# EAGLE design breakoutboard2 (EAGLE 5.06)
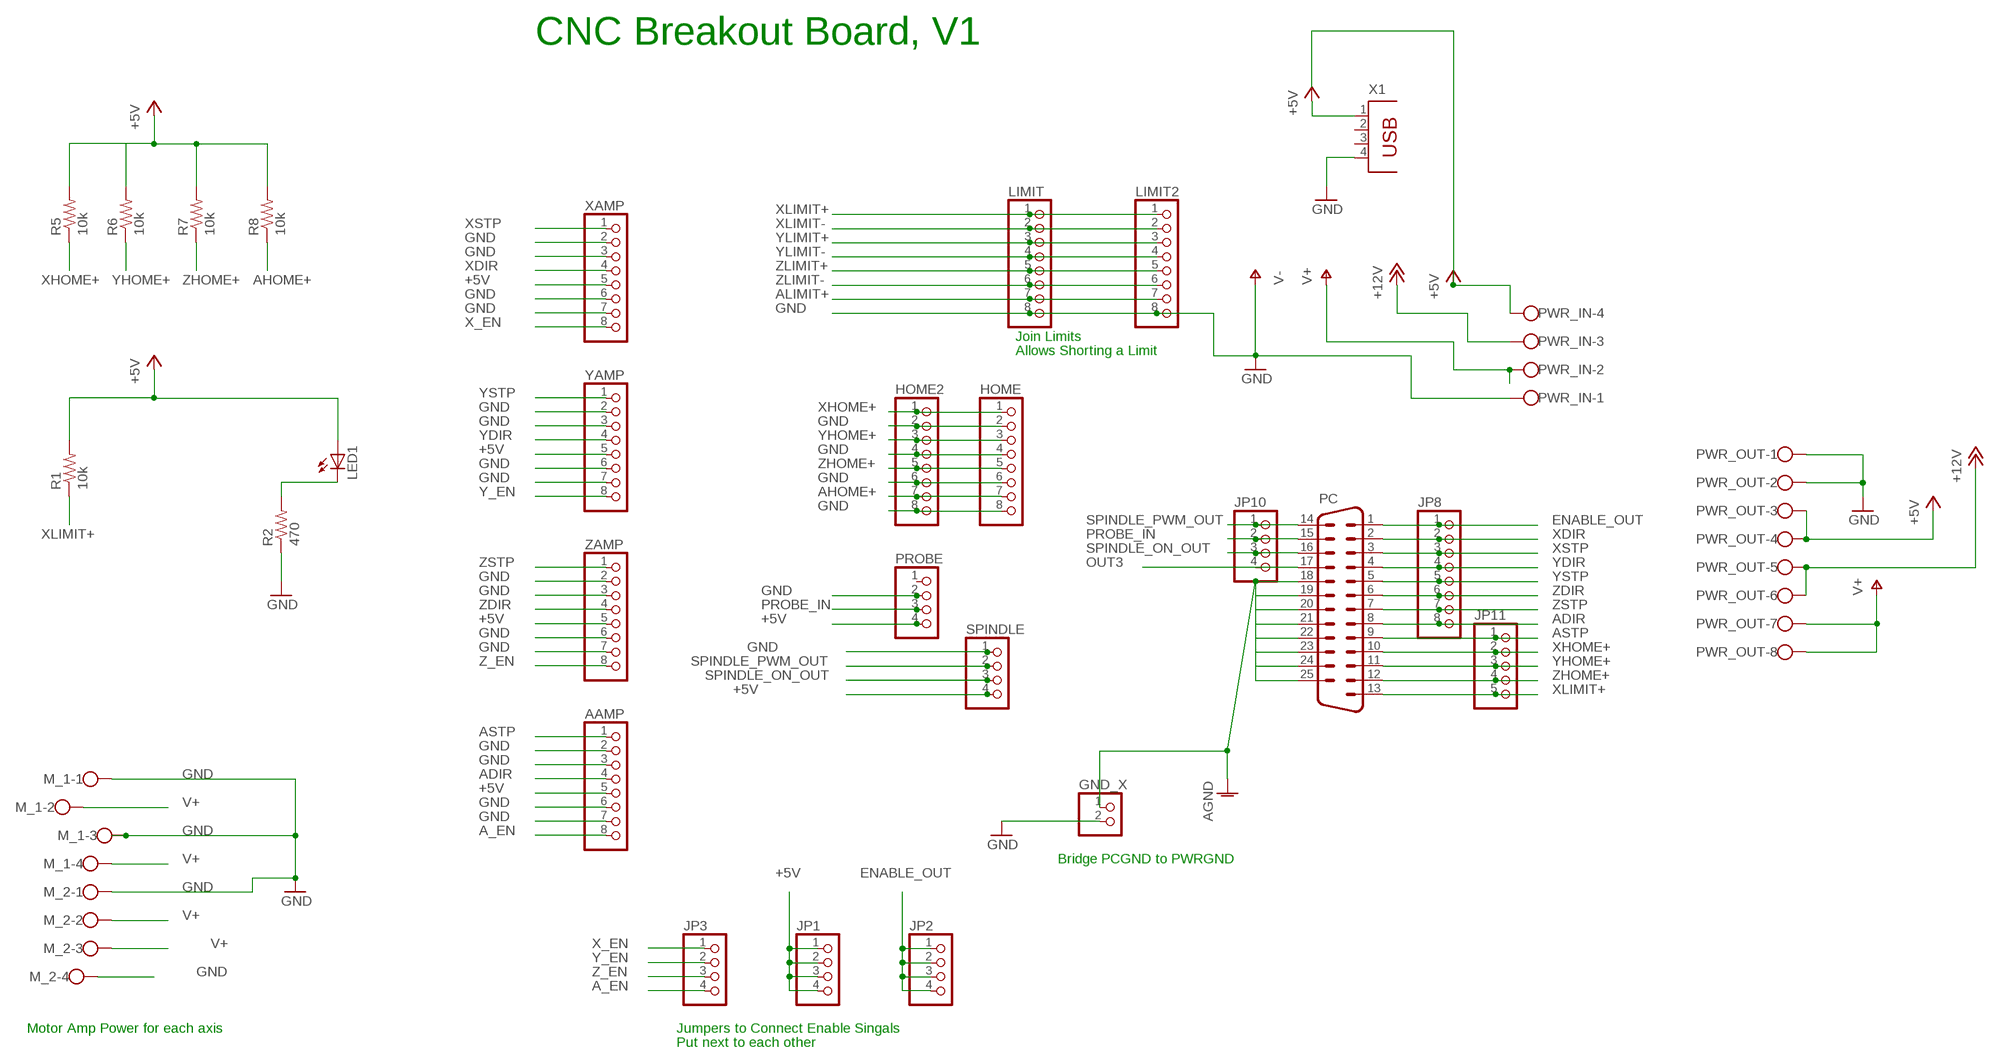
[diagram p0: schematic, sheet 1]

## Parts
AAMP  PINHD-1X8  [1X08]
GND_X  PINHD-1X2  [1X02]
HOME  PINHD-1X8  [1X08]
HOME2  PINHD-1X8  [1X08]
JP1  PINHD-1X4  [1X04]
JP2  PINHD-1X4  [1X04]
JP3  PINHD-1X4  [1X04]
JP8  PINHD-1X8  [1X08]
JP10  PINHD-1X4  [1X04]
JP11  PINHD-1X5  [1X05]
LED1  LED3MM  [LED3MM]
LIMIT  PINHD-1X8  [1X08]
LIMIT2  PINHD-1X8  [1X08]
M_1  W237-04P  [W237-4P]
M_2  W237-04P  [W237-4P]
PC  M25HP  [M25HP]
PROBE  PINHD-1X4  [1X04]
PWR_IN  W237-04P  [W237-4P]
PWR_OUT  W237-08P  [W237-8P]
R1  10k  R-US_0204/7  [0204/7]
R2  470  R-US_0204/2V  [0204V]
R5  10k  R-US_0204/7  [0204/7]
R6  10k  R-US_0204/7  [0204/7]
R7  10k  R-US_0204/7  [0204/7]
R8  10k  R-US_0204/7  [0204/7]
SPINDLE  PINHD-1X4  [1X04]
X1  PN61729  [PN61729]
XAMP  PINHD-1X8  [1X08]
YAMP  PINHD-1X8  [1X08]
ZAMP  PINHD-1X8  [1X08]

## Nets
+5V: AAMP.5 JP1.1 JP1.2 JP1.3 JP1.4 LED1.A PROBE.4 PWR_IN.4 PWR_OUT.3 PWR_OUT.4 R1.2 R5.2 R6.2 R7.2 R8.2 SPINDLE.4 X1.1 XAMP.5 YAMP.5 ZAMP.5
+12V: PWR_IN.3 PWR_OUT.5 PWR_OUT.6
A_EN: AAMP.8 JP3.4
ADIR: AAMP.4 JP8.8 PC.8
AGND: GND_X.1 PC.18 PC.19 PC.20 PC.21 PC.22 PC.23 PC.24 PC.25
AHOME+: HOME2.7 HOME.7 R8.1
ALIMIT+: LIMIT2.7 LIMIT.7
ASTP: AAMP.1 JP11.1 PC.9
ENABLE_OUT: JP2.1 JP2.2 JP2.3 JP2.4 JP8.1 PC.1
GND: AAMP.2 AAMP.3 AAMP.6 AAMP.7 GND_X.2 HOME2.2 HOME2.4 HOME2.6 HOME2.8 HOME.2 HOME.4 HOME.6 HOME.8 LIMIT2.8 LIMIT.8 M_1.1 M_1.3 M_2.1 M_2.4 PROBE.2 PWR_IN.1 PWR_OUT.1 PWR_OUT.2 R2.1 SPINDLE.1 X1.4 XAMP.2 XAMP.3 XAMP.6 XAMP.7 YAMP.2 YAMP.3 YAMP.6 YAMP.7 ZAMP.2 ZAMP.3 ZAMP.6 ZAMP.7 ; supply symbol labelled V-
N$1: LED1.K(C) R2.2
OUT3: JP10.4 PC.17
PROBE_IN: JP10.2 PC.15 PROBE.3
SPINDLE_ON_OUT: JP10.3 PC.16 SPINDLE.3
SPINDLE_PWM_OUT: JP10.1 PC.14 SPINDLE.2
V+: M_1.2 M_1.4 M_2.2 M_2.3 PWR_IN.2 PWR_OUT.7 PWR_OUT.8
X_EN: JP3.1 XAMP.8
XDIR: JP8.2 PC.2 XAMP.4
XHOME+: HOME2.1 HOME.1 JP11.2 PC.10 R5.1
XLIMIT+: JP11.5 LIMIT2.1 LIMIT.1 PC.13 R1.1
XLIMIT-: LIMIT2.2 LIMIT.2
XSTP: JP8.3 PC.3 XAMP.1
Y_EN: JP3.2 YAMP.8
YDIR: JP8.4 PC.4 YAMP.4
YHOME+: HOME2.3 HOME.3 JP11.3 PC.11 R6.1
YLIMIT+: LIMIT2.3 LIMIT.3
YLIMIT-: LIMIT2.4 LIMIT.4
YSTP: JP8.5 PC.5 YAMP.1
Z_EN: JP3.3 ZAMP.8
ZDIR: JP8.6 PC.6 ZAMP.4
ZHOME+: HOME2.5 HOME.5 JP11.4 PC.12 R7.1
ZLIMIT+: LIMIT2.5 LIMIT.5
ZLIMIT-: LIMIT2.6 LIMIT.6
ZSTP: JP8.7 PC.7 ZAMP.1
Unconnected: PROBE.1 X1.2 X1.3

## Notes on the sheet
- CNC Breakout Board, V1
- Join Limits
- Allows Shorting a Limit
- Bridge PCGND to PWRGND
- Motor Amp Power for each axis | Jumpers to Connect Enable Singals
- Put next to each other

## Library data of the parts
AAMP HOME HOME2 JP8 LIMIT LIMIT2 XAMP YAMP ZAMP = pinhead:PINHD-1X8: PIN HEADER
GND_X = pinhead:PINHD-1X2: PIN HEADER
JP1-JP3 JP10 PROBE SPINDLE = pinhead:PINHD-1X4: PIN HEADER
JP11 = pinhead:PINHD-1X5: PIN HEADER
LED1 = led:LED: LED OSRAM: - CHIPLED LG R971, LG N971, LY N971, LG Q971, LY Q971, LO R971, LY R971 LH N974, LH R974 LS Q976, LO Q976, LY Q976 LO Q996 - Hyper CHIPLED LW Q18S LB Q993, LB Q99A, LB R99A - SideLED LS A670, LO A670, LY A670, LG A670, LP A670 LB A673, LV A673, LT A673, LW A673 LH A674 LY A675 LS A676, LA A676, LO A676, LY A676, LW A676 LS A679, LY A679, LG A679 - Hyper Micro SIDELED® LS Y876, LA Y876, LO Y876, LY Y876 LT Y87S - SmartLED LW L88C, LW L88S LB L89C, LB L89S, LG L890 LS L89K, LO L89K, LY L89K LS L896, LA L896, LO L896, LY L896 - TOPLED LS T670, LO T670, LY T670, LG T670, LP T670 LSG T670, LSP T670, LSY T670, LOP T670, LYG T670 LG T671, LOG T671, LSG T671 LB T673, LV T673, LT T673, LW T673 LH T674 LS T676, LA T676, LO T676, LY T676, LB T676, LH T676, LSB T676, LW T676 LB T67C, LV T67C, LT T67C, LS T67K, LO T67K, LY T67K, LW E67C LS E67B, LA E67B, LO E67B, LY E67B, LB E67C, LV E67C, LT E67C LW T67C LS T679, LY T679, LG T679 LS T770, LO T770, LY T770, LG T770, LP T770 LB T773, LV T773, LT T773, LW T773 LH T774 LS E675, LA E675, LY E675, LS T675 LS T776, LA T776, LO T776, LY T776, LB T776 LHGB T686 LT T68C, LB T68C - Hyper Mini TOPLED® LB M676 - Mini TOPLED Santana® LG M470 LS M47K, LO M47K, LY M47K Source: http://www.osram.convergy.de LUXEON: - LUMILED® LXK2-PW12-R00, LXK2-PW12-S00, LXK2-PW14-U00, LXK2-PW14-V00 LXK2-PM12-R00, LXK2-PM12-S00, LXK2-PM14-U00 LXK2-PE12-Q00, LXK2-PE12-R00, LXK2-PE12-S00, LXK2-PE14-T00, LXK2-PE14-U00 LXK2-PB12-K00, LXK2-PB12-L00, LXK2-PB12-M00, LXK2-PB14-N00, LXK2-PB14-P00, LXK2-PB14-Q00 LXK2-PR12-L00, LXK2-PR12-M00, LXK2-PR14-Q00, LXK2-PR14-R00 LXK2-PD12-Q00, LXK2-PD12-R00, LXK2-PD12-S00 LXK2-PH12-R00, LXK2-PH12-S00 LXK2-PL12-P00, LXK2-PL12-Q00, LXK2-PL12-R00 Source: www.luxeon.com KINGBRIGHT: KA-3528ASYC Source: www.kingbright.com
M_1 M_2 PWR_IN = con-wago-508:W237-04P: WAGO SREW CLAMP
PC = con-subd:M25: SUB-D
PWR_OUT = con-wago-508:W237-08P: WAGO SREW CLAMP
R1 R2 R5-R8 = rcl:R-US_: RESISTOR, American symbol
X1 = con-berg:PN61729: BERG USB connector

## Board
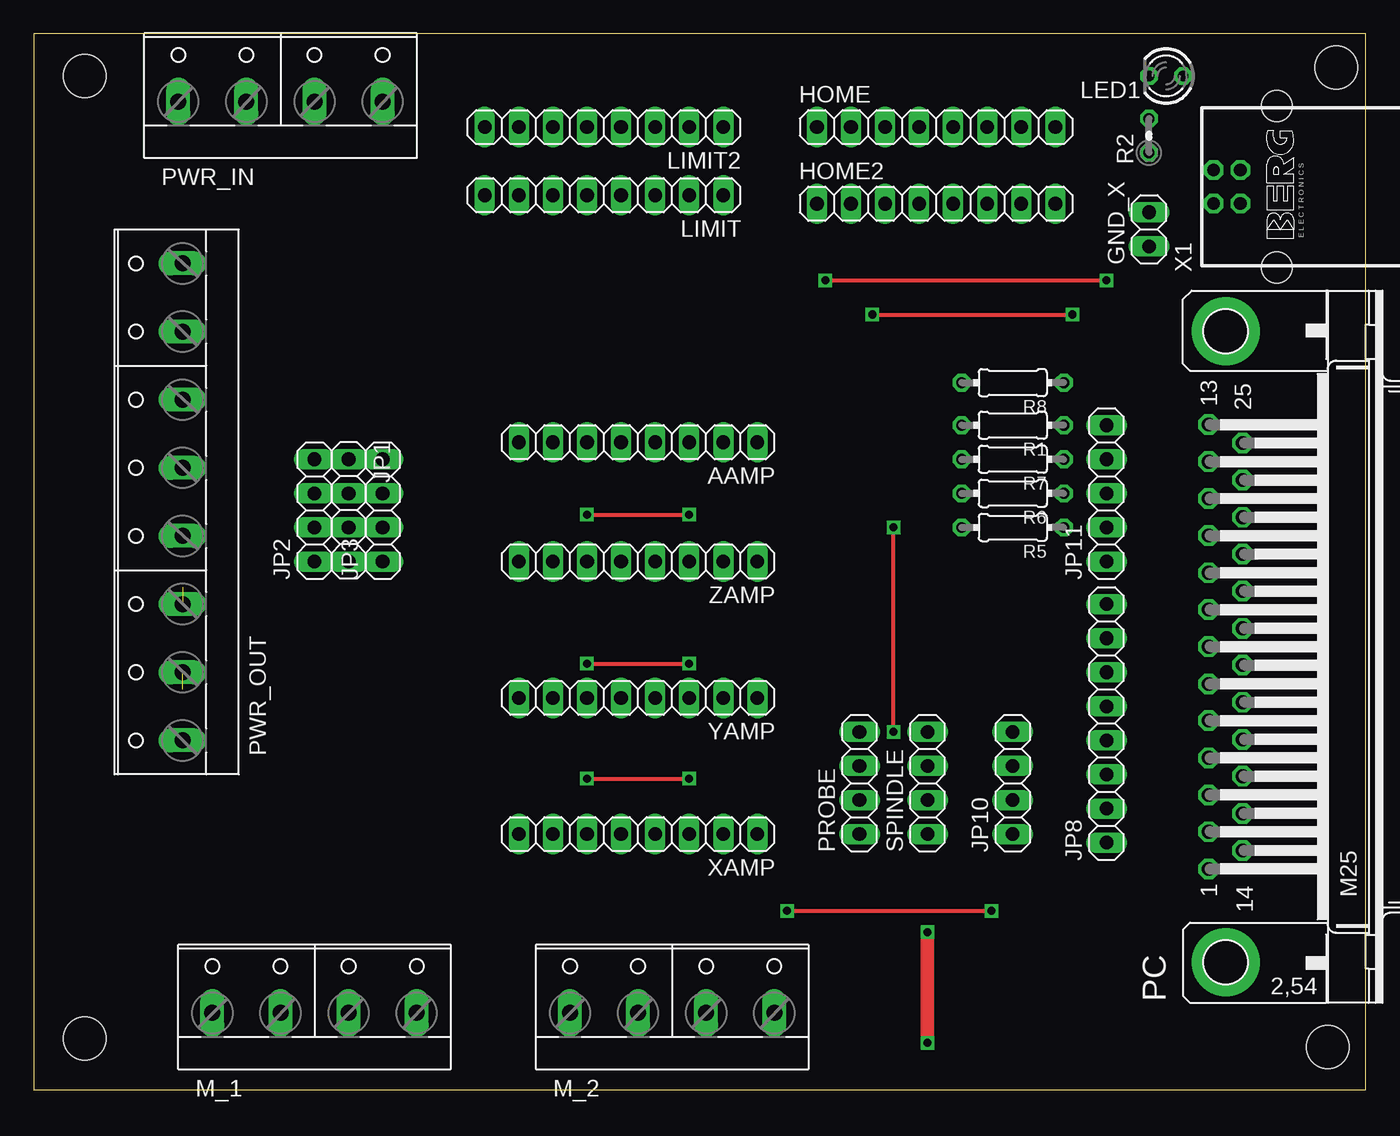
[diagram p1: board, top side]
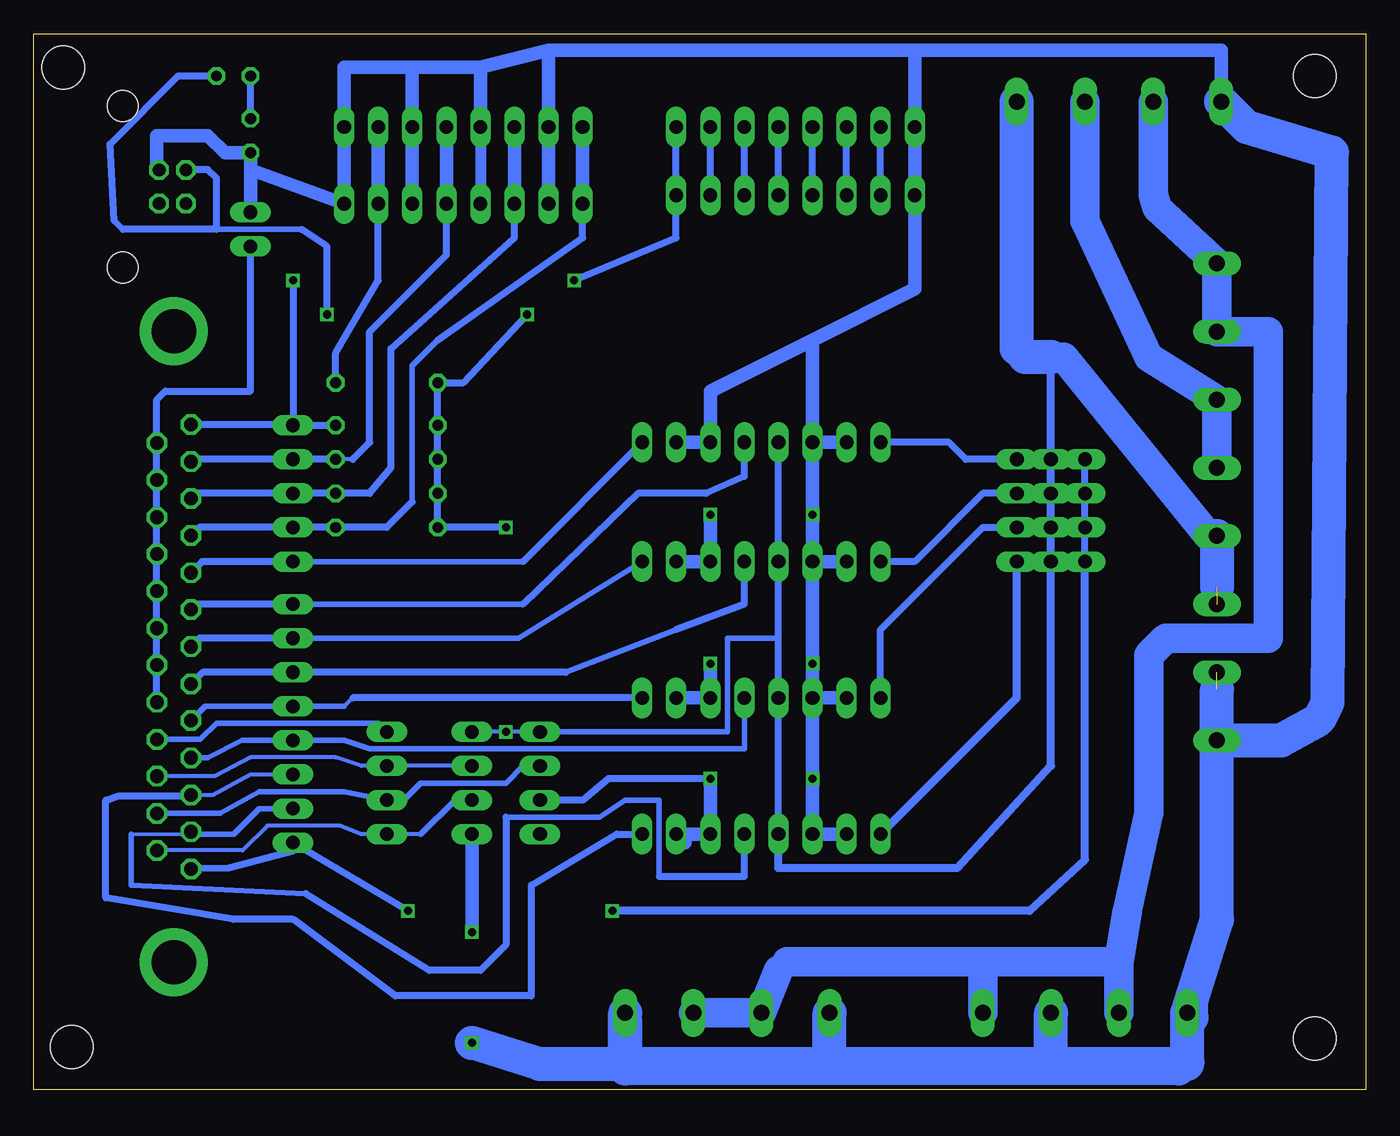
[diagram p2: board, bottom side, seen from below]

Size 99.36 x 78.73 mm. Coordinates in mm from the lower left corner, seen from the top.
Outline: 0,0 99.36,0 99.36,78.73 0,78.73 0,0
Copper layers (1*16): Top 0.035mm / dielectric 1.5mm / Bottom 0.035mm
Design rules "default": minimum track width 10mil, minimum drill 24mil, track to track 8mil, track to pad 8mil, pad to pad 8mil, via to via 8mil, smd to smd 8mil, copper to edge 40mil, drill to drill 8mil, minimum pad ring 10mil, minimum via ring 8mil, stop-mask expansion 4mil, vias tented up to drill 0mil, thermal gap 10mil
Holes 3.2 mm at 97.16,76.2 96.52,3.17 3.81,3.81 3.81,75.56

### Footprints (pad centres in the part's own frame; a part is rotated, then mirrored left to right if it is on the bottom)
1X08 = drill 1.016 long: 1 -8.89,0; 2 -6.35,0; 3 -3.81,0; 4 -1.27,0; 5 1.27,0; 6 3.81,0; 7 6.35,0; 8 8.89,0
1X02 = drill 1.016 long: 1 -1.27,0; 2 1.27,0
1X04 = drill 1.016 long: 1 -3.81,0; 2 -1.27,0; 3 1.27,0; 4 3.81,0
1X05 = drill 1.016 long: 1 -5.08,0; 2 -2.54,0; 3 0,0; 4 2.54,0; 5 5.08,0
LED3MM = drill 0.813 octagon: A -1.27,0; K 1.27,0
W237-4P = drill 1.194 long: 1 -7.62,-0.635; 2 -2.54,-0.635; 3 2.54,-0.635; 4 7.62,-0.635
M25HP = drill 1.016 octagon: 1 -16.561,1.27; 2 -13.792,1.27; 3 -11.049,1.27; 4 -8.28,1.27; 5 -5.512,1.27; 6 -2.769,1.27; 7 0,1.27; 8 2.769,1.27; 9 5.512,1.27; 10 8.28,1.27; 11 11.049,1.27; 12 13.792,1.27; 13 16.561,1.27; 14 -15.189,-1.27; 15 -12.421,-1.27; 16 -9.652,-1.27; 17 -6.909,-1.27; 18 -4.14,-1.27; 19 -1.372,-1.27; 20 1.372,-1.27; 21 4.14,-1.27; 22 6.909,-1.27; 23 9.652,-1.27; 24 12.421,-1.27; 25 15.189,-1.27 | drill 3.302 pad 5.08 round: G1 -23.52,0; G2 23.52,0
W237-8P = drill 1.194 long: 1 -17.78,-0.635; 2 -12.7,-0.635; 3 -7.62,-0.635; 4 -2.54,-0.635; 5 2.54,-0.635; 6 7.62,-0.635; 7 12.7,-0.635; 8 17.78,-0.635
0204/7 = drill 0.813 octagon: 1 -3.81,0; 2 3.81,0
0204V = drill 0.813 octagon: 1 -1.27,0; 2 1.27,0
PN61729 = drill 0.95 octagon: 1 1.25,4.71; 2 -1.25,4.71; 3 -1.25,2.71; 4 1.25,2.71 | hole 2.3: -6.02,0; 6.02,0

### Placement (x,y rotation side)
AAMP  45.09,48.26 180 top
GND_X  83.19,64.14 90 top
HOME  67.31,71.75 0 top
HOME2  67.31,66.04 0 top
JP1  23.5,43.18 270 top
JP2  20.95,43.18 90 top
JP3  26.04,43.18 90 top
JP8  80.01,27.3 90 top
JP10  73.03,22.86 90 top
JP11  80.01,44.45 90 top
LED1  84.45,75.56 180 top
LIMIT  42.55,66.67 180 top
LIMIT2  42.55,71.75 180 top
M_1  20.95,6.35 0 top
M_2  47.62,6.35 0 top
PC  88.9,33.02 90 top
PROBE  61.59,22.86 90 top
PWR_IN  18.41,74.3 0 top
PWR_OUT  10.48,43.81 90 top
R1  73.03,49.53 180 top
R2  83.19,71.12 90 top
R5  73.03,41.91 180 top
R6  73.03,44.45 180 top
R7  73.03,46.99 180 top
R8  73.03,52.7 180 top
SPINDLE  66.67,22.86 90 top
X1  92.71,67.31 90 top
XAMP  45.09,19.05 180 top
YAMP  45.09,29.21 180 top
ZAMP  45.09,39.37 180 top

### Tracks (layer width: path | path; a pad name or v marks a point on that pad's centre or on a via)
+5V  (via drill 0.6)  (1 unrouted)
  Top 0.305: v64.14,26.67 v64.14,41.91 | v62.55,57.78 v77.47,57.78
  Bottom 0.305: 88.27,68.58 88.27,68.56 X1.1 87.98,68.58 | 23.5,54.61 JP1.1 | 43.81,18.41 XAMP.5 | PROBE.4 v64.14,26.67 SPINDLE.4
  Bottom 0.406: JP1.1 JP1.2 JP1.3 JP1.4 | 92.71,64.14 93.34,64.77 | 79.38,64.14 85.72,64.14 | PROBE.4 47.62,26.67 47.62,33.66 43.81,33.66
  Bottom 0.508: LED1.A 88.58,75.56 93.66,70.48 93.34,64.77 | 92.71,64.14 85.72,64.14 85.72,67.94 86.36,68.58 87.98,68.58 | AAMP.5 ZAMP.5 43.81,33.66 YAMP.5 XAMP.5 | v64.14,41.91 R5.2 R6.2 R7.2 R1.2 R8.2 67.31,52.7 v62.55,57.78 | 79.38,64.14 77.47,62.87 v77.47,57.78
  Bottom 0.61: 23.5,54.61 23.5,24.13 30.48,16.51 43.81,16.51 43.81,18.41
  Bottom 1.016: 25.4,54.61 26.04,55.24
  Bottom 1.422: 11.75,41.27 PWR_OUT.4
  Bottom 2.184: 11.75,41.27 22.54,54.61 23.5,54.61
  Bottom 2.54: 26.04,55.24 PWR_IN.4 | 23.5,54.61 25.4,54.61 | PWR_OUT.4 11.11,37.47
+12V
  Bottom 1.422: 11.11,46.99 10.48,46.35 PWR_OUT.5
  Bottom 2.184: PWR_IN.3 20.95,64.77 16.19,54.61 PWR_OUT.6 11.11,46.99
A_EN
  Bottom 0.508: JP3.4 29.84,46.99 31.11,48.26 AAMP.8
ADIR
  Bottom 0.406: 62.87,36.2 JP8.8
  Bottom 0.508: JP8.8 87.22,36.2 PC.8 | 62.87,36.2 54.29,44.45 49.21,44.45 46.35,45.72 AAMP.4
AGND
  Bottom 0.305: PC.22 90.17,40.64
  Bottom 0.508: PC.18 PC.19 PC.20 PC.21 PC.22 PC.23 PC.24 PC.25 90.17,51.44 89.53,52.07 83.19,52.07 GND_X.1
AHOME+
  Bottom 0.508: HOME2.7 73.66,60.33 76.83,54.93 R8.1
  Bottom 1.016: HOME2.7 HOME.7
ALIMIT+
  Bottom 0.508: LIMIT.7 LIMIT2.7
ASTP
  Bottom 0.406: 62.87,39.37 JP11.1
  Bottom 0.508: JP11.1 86.79,39.37 PC.9 | 62.87,39.37 AAMP.1
ENABLE_OUT  (via drill 0.6)
  Top 0.305: v56.2,13.34 v71.44,13.34
  Bottom 0.305: JP8.1 80.01,17.78
  Bottom 0.406: JP2.3 20.95,43.81
  Bottom 0.508: JP2.4 JP2.3 JP2.2 JP2.1 | 80.01,17.78 84.82,16.51 PC.1 | v71.44,13.34 JP8.1
  Bottom 0.61: JP2.1 20.95,17.14 25.08,13.34 v56.2,13.34
GND  (via drill 0.6)  (1 unrouted)
  Top 0.305: v41.27,42.86 v48.9,42.86 | v41.27,31.75 v48.9,31.75 | v41.27,23.18 v48.9,23.18
  Top 1.016: v66.67,3.49 v66.67,11.75
  Bottom 0.305: XAMP.2 51.44,17.78 | YAMP.2 51.44,27.94 | PROBE.2 62.23,21.59
  Bottom 0.406: ZAMP.3 ZAMP.2 | v41.27,42.86 ZAMP.6 | YAMP.3 YAMP.2 | v41.27,31.75 YAMP.6 | 33.66,59.69 LIMIT.8 LIMIT2.8 33.66,77.47
  Bottom 0.508: v48.9,23.18 56.52,23.18 58.42,21.59 PROBE.2
  Bottom 0.813: HOME.4 HOME2.4
  Bottom 1.016: HOME2.6 HOME.6 71.12,76.2 | HOME2.2 HOME.2 60.96,77.47 | HOME2.8 HOME.8 | HOME2.8 83.19,68.58 | 83.19,68.58 GND_X.2 | 83.19,68.58 R2.1 85.09,69.85 86.36,71.12 90.17,71.12 90.17,68.73 X1.4 | AAMP.2 AAMP.3 48.9,52.07 41.27,55.88 | ZAMP.2 ZAMP.3 v48.9,42.86 | AAMP.6 AAMP.7 | ZAMP.6 ZAMP.7 | YAMP.6 YAMP.7 | YAMP.2 YAMP.3 v48.9,31.75 | XAMP.7 XAMP.6 v41.27,23.18 YAMP.6 | 41.27,55.88 AAMP.6 | PWR_IN.1 10.79,77.47 33.66,77.47 | 60.96,77.47 66.04,76.2 | 66.04,76.2 HOME.4 | 66.04,76.2 71.12,76.2 | HOME2.8 76.2,76.2 71.12,76.2 | 41.27,55.88 33.66,59.69 33.66,77.47 | 33.66,77.47 60.96,77.47 | 50.8,18.41 XAMP.2 XAMP.3 v48.9,23.18 | ZAMP.6 v41.27,42.86 AAMP.6 | YAMP.6 v41.27,31.75 ZAMP.6 | v66.67,11.75 SPINDLE.1
  Bottom 2.54: 55.24,5.08 55.24,1.91 | 55.24,5.08 M_2.4 | 40.01,1.91 55.24,1.91 | 40.01,1.91 M_2.1 | 23.5,1.91 40.01,1.91 | 23.5,1.91 M_1.3 | 23.5,1.91 13.34,1.91 13.34,2.22 | 13.34,2.22 M_1.1 11.11,12.7 | 11.11,25.72 PWR_OUT.1 | v66.67,3.49 61.59,1.91 55.24,1.91 | 55.24,5.08 55.24,1.59 13.97,1.59 13.34,2.22 | 13.34,2.22 13.34,5.08 13.02,5.4 13.02,6.67 11.11,12.7 | 11.11,12.7 11.11,25.72 | 11.11,25.72 11.43,26.04 PWR_OUT.1 | PWR_OUT.1 6.35,26.04 3.49,27.62 2.86,28.89 2.54,69.85 8.89,71.75 PWR_IN.1 | PWR_OUT.1 11.11,29.84
N$1
  Bottom 0.508: R2.2 LED1.K
OUT3
  Bottom 0.305: JP10.4 73.66,27.3
  Bottom 0.406: PC.17 86.92,26.11 85.72,27.3 73.66,27.3
PROBE_IN
  Bottom 0.305: 71.75,21.59 JP10.2
  Bottom 0.406: PC.15 85.45,20.6 82.55,22.23 76.2,22.23 JP10.2 | 71.75,21.59 70.48,22.86 64.14,22.86 62.87,24.13 PROBE.3
SPINDLE_ON_OUT
  Bottom 0.305: PC.16 85.85,23.37 83.19,24.77 76.83,24.77 74.93,24.13 JP10.3 SPINDLE.3
SPINDLE_PWM_OUT
  Bottom 0.305: PC.14 83.77,17.83 81.92,19.68 76.52,19.68 74.93,19.05 JP10.1 70.48,19.05 | SPINDLE.2 67.94,21.59
  Bottom 0.406: 67.94,21.59 70.48,19.05
V+
  Bottom 1.016: M_2.2 M_2.3
  Bottom 1.422: 43.18,9.53 43.81,8.89
  Bottom 2.184: M_2.3 M_2.2 43.81,8.89 | PWR_IN.2 15.88,66.67 15.56,65.72 PWR_OUT.8 PWR_OUT.7 7.3,56.52 7.3,33.66 14.92,33.66 16.19,32.38 16.19,20.64 17.78,13.34 18.41,9.53 | M_1.2 18.41,9.53 | 18.41,9.53 28.57,9.53 | 28.57,9.53 M_1.4 | 28.57,9.53 43.18,9.53
X_EN
  Bottom 0.61: JP3.1 26.04,29.21 XAMP.8
XDIR
  Bottom 0.254: 92.08,19.05 87.63,19.05 PC.2
  Bottom 0.305: PC.2 87.45,19.05
  Bottom 0.406: JP8.2 82.55,20.95 84.45,19.05 87.45,19.05 | 92.08,19.05 92.08,15.24 79.06,14.61 | 64.14,20.32 57.15,20.32 55.24,21.59 52.7,21.59 52.7,15.88
  Bottom 0.508: XAMP.4 46.35,15.88 52.7,15.88 | 79.06,14.61 69.85,8.89 66.04,8.89 64.14,10.79 64.14,20.32
XHOME+
  Bottom 0.406: 71.12,43.81 71.12,53.98 69.22,55.88
  Bottom 0.508: PC.10 87.02,41.91 JP11.2 R5.1 73.03,41.91 71.12,43.81 | 69.22,55.88 58.42,63.5 HOME2.1
  Bottom 1.016: HOME2.1 HOME.1
XLIMIT+  (via drill 0.6)
  Top 0.305: v59.05,60.33 v80.01,60.33
  Bottom 0.305: 80.06,49.58 JP11.5 R1.1
  Bottom 0.508: LIMIT2.1 LIMIT.1 51.44,63.5 v59.05,60.33 | 80.06,49.58 PC.13 | R1.1 JP11.5 v80.01,60.33
XLIMIT-
  Bottom 0.508: LIMIT.2 LIMIT2.2
XSTP
  Bottom 0.305: JP8.3 83.19,23.5 85.98,21.97 PC.3 87.69,21.91
  Bottom 0.508: XAMP.1 55.88,19.05 62.23,15.24 62.23,6.99 72.39,6.99 80.01,12.7 84.45,12.7 93.98,14.29 93.98,21.59 93.03,21.91 87.69,21.91
Y_EN
  Bottom 0.508: JP3.2 28.57,41.91 36.2,34.29 YAMP.8
YDIR
  Bottom 0.406: PC.4 86.39,24.74 83.82,26.04 JP8.4 76.2,26.04 74.3,25.4 46.35,25.4 YAMP.4
YHOME+
  Bottom 0.305: 87.25,44.45 PC.11
  Bottom 0.508: 87.25,44.45 JP11.3 R6.1 74.3,44.45 72.71,46.35 72.71,55.24 63.5,63.5 HOME2.3
  Bottom 1.016: 63.5,65.41 HOME2.3 HOME.3
YLIMIT+
  Bottom 0.508: LIMIT.3 LIMIT2.3
YLIMIT-
  Bottom 0.508: LIMIT.4 LIMIT2.4
YSTP
  Bottom 0.305: 75.56,29.21 76.2,28.57
  Bottom 0.406: PC.5 86.56,28.57 JP8.5 76.2,28.57
  Bottom 0.508: YAMP.1 75.56,29.21
Z_EN
  Bottom 0.508: JP3.3 28.57,44.45 33.66,39.37 ZAMP.8
ZDIR
  Bottom 0.406: 51.44,34.29 59.69,31.11
  Bottom 0.508: PC.6 86.77,31.11 JP8.6 59.69,31.11 | 51.44,34.29 46.35,36.2 ZAMP.4
ZHOME+
  Bottom 0.305: 87.45,46.99 PC.12 | 75.56,46.99 R7.1
  Bottom 0.508: 87.45,46.99 JP11.4 R7.1 | 75.56,46.99 74.3,48.26 74.3,56.52 68.58,62.23 HOME2.5
  Bottom 1.016: HOME2.5 HOME.5
ZLIMIT+
  Bottom 0.508: LIMIT.5 LIMIT2.5
ZLIMIT-
  Bottom 0.508: LIMIT.6 LIMIT2.6
ZSTP
  Bottom 0.406: JP8.7 63.18,33.66 ZAMP.1
  Bottom 0.508: JP8.7 87,33.66 PC.7